# EAGLE design antique-lux (EAGLE 6.4)
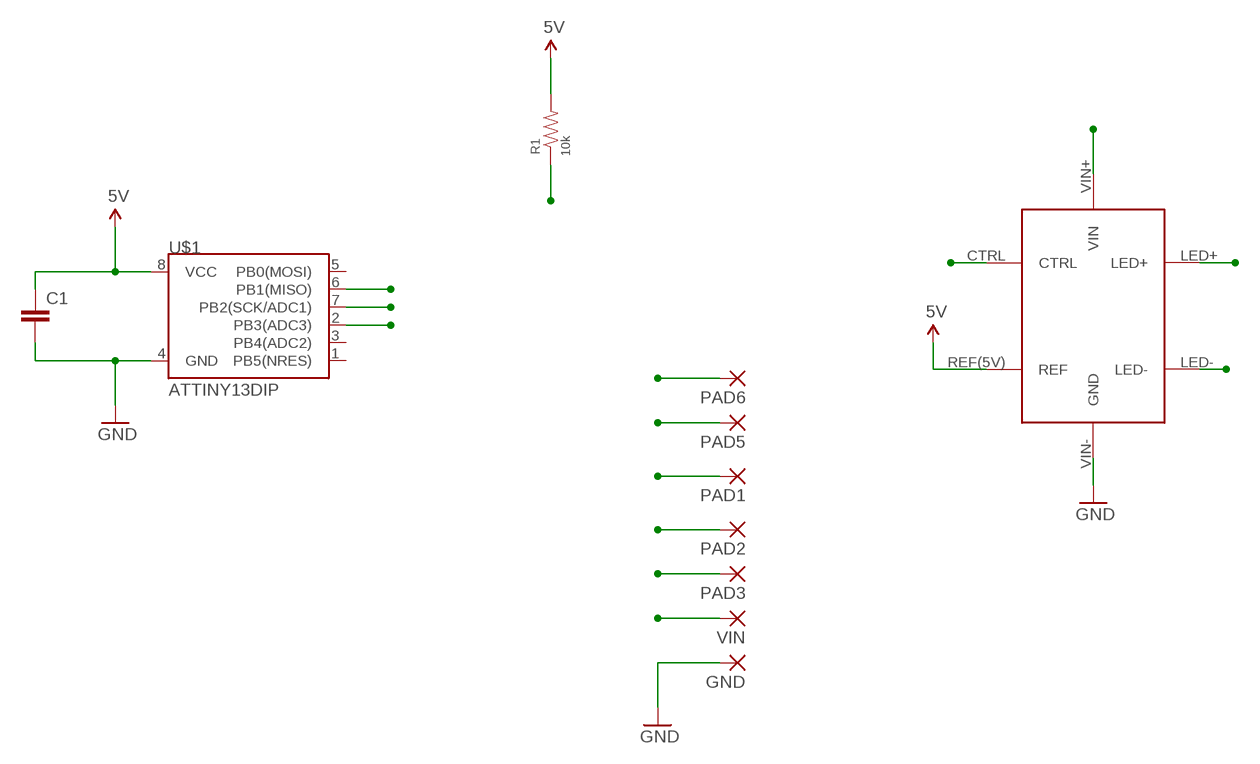
[diagram p0: schematic, sheet 1]

## Parts
C1  CAPEZ  [CAP-PTH-SMALLEZ]
GND  WIREPAD2,54/0,8  [2,54/0,8]
PAD1  WIREPAD2,54/0,8  [2,54/0,8]
PAD2  WIREPAD2,54/0,8  [2,54/0,8]
PAD3  WIREPAD2,54/0,8  [2,54/0,8]
PAD5  WIREPAD2,54/0,8  [2,54/0,8]
PAD6  WIREPAD2,54/0,8  [2,54/0,8]
R1  10k  RESISTOR-PTH  [VERT-PTH]
U$1  ATTINY13DIP  [DIP08]
U$2  LUXDRIVE-PINNED  [LUXDRIVE-BUCKPUCK-PINNED]
VIN  WIREPAD2,54/0,8  [2,54/0,8]

## Nets
5V: C1.1 R1.2(G$2) U$1.8(VCC) U$2.REF(5V)(REF)
CTRL: R1.1(G$1) U$1.6(PB1(MISO)) U$2.CTRL
GND: C1.2 GND.1(P) PAD6.1(P) U$1.4(GND) U$2.VIN-(GND)
LED+: PAD2.1(P) U$2.LED+
LED-: PAD3.1(P) U$2.LED-
PWR_LED: PAD1.1(P) U$1.2(PB3(ADC3))
SW_IN: PAD5.1(P) U$1.7(PB2(SCK/ADC1))
VIN: U$2.VIN+(VIN) VIN.1(P)
Unconnected: U$1.1(PB5(NRES)) U$1.3(PB4(ADC2)) U$1.5(PB0(MOSI))

## Library data of the parts
C1 = SparkFun-Capacitors:CAP: Capacitor Standard 0603 ceramic capacitor, and 0.1" leaded capacitor.
GND PAD1-PAD3 PAD5 PAD6 VIN = wirepad:WIREPAD: Wire PAD connect wire on PCB
R1 = Synapseware:RESISTOR-PTH
U$1 = SparkFun-DigitalIC:ATTINY13: Atmel 8-pin 1kB flash uC
U$2 = Synapseware:LUXDRIVE-PINNED

## Board
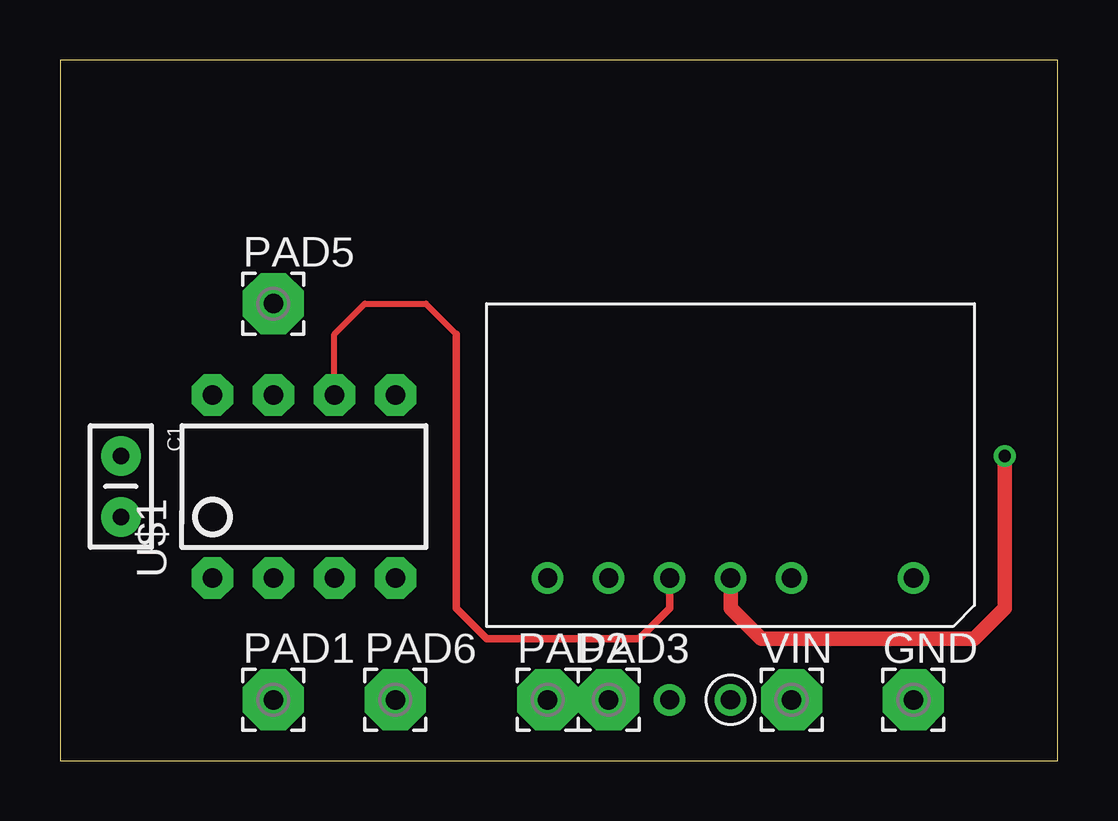
[diagram p1: board, top side]
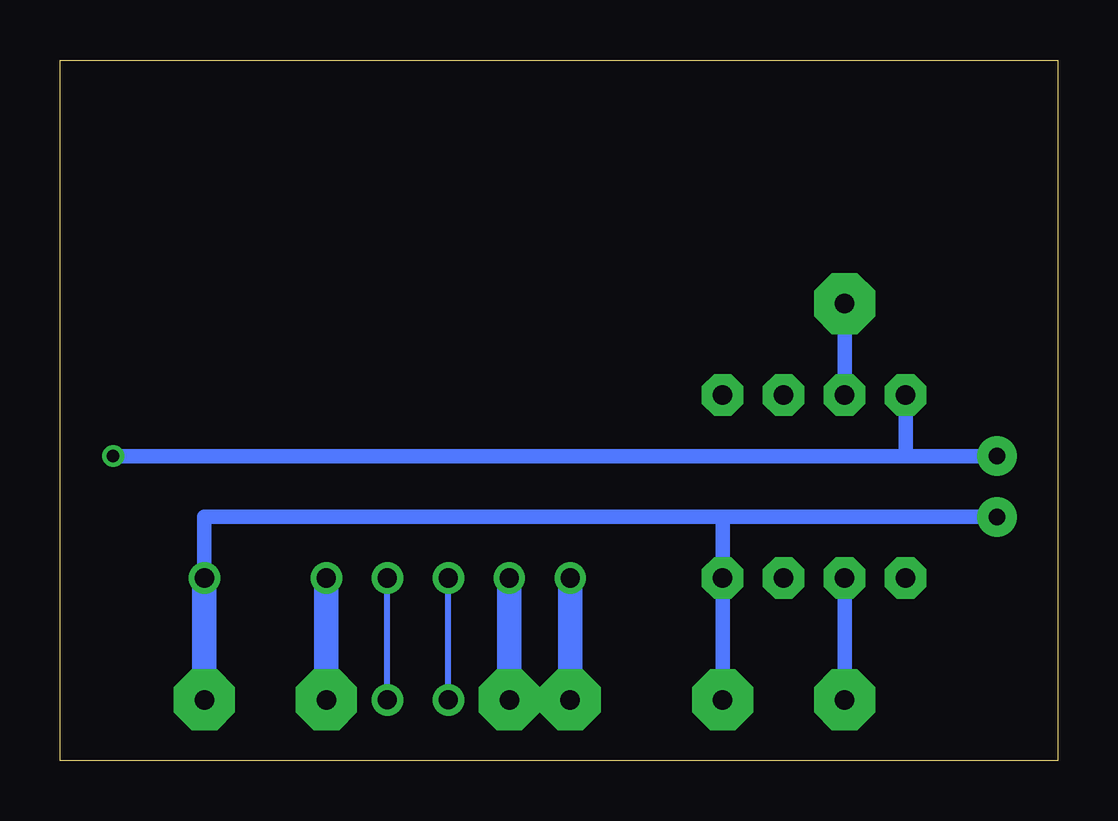
[diagram p2: board, bottom side, seen from below]

Size 41.58 x 29.2 mm. Coordinates in mm from the lower left corner, seen from the top.
Outline: 0,0 41.58,0 41.58,29.2 0,29.2 0,0
Copper layers (1*16): Top 0.035mm / dielectric 1.5mm / Bottom 0.035mm
Design rules "default": minimum track width 10mil, minimum drill 0.6mm, track to track 8mil, track to pad 8mil, pad to pad 8mil, via to via 8mil, smd to smd 8mil, copper to edge 40mil, drill to drill 8mil, minimum pad ring 10mil, minimum via ring 8mil, stop-mask expansion 4mil, vias tented up to drill 0mil, thermal gap 10mil

### Footprints (pad centres in the part's own frame; a part is rotated, then mirrored left to right if it is on the bottom)
CAP-PTH-SMALLEZ = drill 0.7 pad 1.651: 1 0,0; 2 2.54,0
2,54/0,8 = drill 0.813 pad 2.54 octagon: 1 0,0
VERT-PTH = drill 0.8: 1 -1.27,0; 2 1.27,0
DIP08 = drill 0.813 pad 1.727 octagon: 1 -3.81,-3.81; 2 -1.27,-3.81; 3 1.27,-3.81; 4 3.81,-3.81; 5 3.81,3.81; 6 1.27,3.81; 7 -1.27,3.81; 8 -3.81,3.81
LUXDRIVE-BUCKPUCK-PINNED = drill 0.8: CTRL 10.16,0; LED+ 15.24,0; LED- 12.7,0; REF(5V) 7.62,0; VIN+ 5.08,0; VIN- 0,0

### Placement (x,y rotation side)
C1  2.54,12.7 270 top
GND  35.56,2.54 0 top
PAD1  8.89,2.54 0 top
PAD2  20.32,2.54 0 top
PAD3  22.86,2.54 0 top
PAD5  8.89,19.05 0 top
PAD6  13.97,2.54 0 top
R1  26.67,2.54 0 top
U$1  10.16,11.43 0 top
U$2  35.56,7.62 180 top
VIN  30.48,2.54 0 top

### Tracks (layer width: path | path; a pad name or v marks a point on that pad's centre or on a via)
5V  (via drill 0.51)
  Top 0.61: U$2.REF(5V) 27.94,6.35 29.21,5.08 38.1,5.08 39.37,6.35 v39.37,12.7
  Bottom 0.254: R1.2 U$2.REF(5V)
  Bottom 0.61: C1.1 6.35,12.7 | U$1.8 6.35,12.7 | 6.35,12.7 v39.37,12.7
CTRL
  Top 0.254: U$1.6 11.43,17.78 12.7,19.05 15.24,19.05 16.51,17.78
  Top 0.305: U$2.CTRL 25.4,6.35 24.13,5.08 17.78,5.08 16.51,6.35 16.51,17.78
  Bottom 0.254: R1.1 U$2.CTRL
GND
  Bottom 0.61: PAD6.1 U$1.4 13.97,10.16 | C1.2 13.97,10.16 | 13.97,10.16 35.56,10.16 U$2.VIN-
  Bottom 1.016: GND.1 U$2.VIN-
LED+
  Bottom 1.016: U$2.LED+ PAD2.1
LED-
  Bottom 1.016: U$2.LED- PAD3.1
PWR_LED
  Bottom 0.61: U$1.2 PAD1.1
SW_IN
  Bottom 0.61: U$1.7 PAD5.1
VIN
  Bottom 1.016: U$2.VIN+ VIN.1